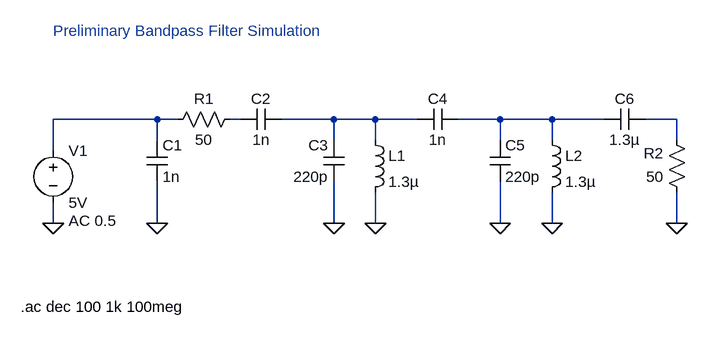
[diagram p0: schematic BandpassSimulation_1.asc]
BandpassSimulation_1.asc, the LTspice schematic file:
Version 4
SHEET 1 996 680
WIRE 176 64 16 64
WIRE 208 64 176 64
WIRE 304 64 288 64
WIRE 448 64 368 64
WIRE 512 64 448 64
WIRE 576 64 512 64
WIRE 704 64 640 64
WIRE 784 64 704 64
WIRE 864 64 784 64
WIRE 976 64 928 64
WIRE 176 96 176 64
WIRE 448 96 448 64
WIRE 512 96 512 64
WIRE 704 96 704 64
WIRE 784 96 784 64
WIRE 976 96 976 64
WIRE 16 112 16 64
WIRE 16 224 16 192
WIRE 176 224 176 160
WIRE 448 224 448 160
WIRE 512 224 512 176
WIRE 704 224 704 160
WIRE 784 224 784 176
WIRE 976 224 976 176
FLAG 16 224 0
FLAG 176 224 0
FLAG 448 224 0
FLAG 512 224 0
FLAG 704 224 0
FLAG 784 224 0
FLAG 976 224 0
SYMBOL cap 160 96 R0
SYMATTR InstName C1
SYMATTR Value 1n
SYMBOL cap 368 48 R90
WINDOW 0 0 32 VBottom 2
WINDOW 3 32 32 VTop 2
SYMATTR InstName C2
SYMATTR Value 1n
SYMBOL cap 464 160 R180
WINDOW 0 24 56 Left 2
WINDOW 3 24 8 Left 2
SYMATTR InstName C3
SYMATTR Value 220p
SYMBOL ind 496 80 R0
SYMATTR InstName L1
SYMATTR Value 1.3µ
SYMBOL cap 640 48 R90
WINDOW 0 0 32 VBottom 2
WINDOW 3 32 32 VTop 2
SYMATTR InstName C4
SYMATTR Value 1n
SYMBOL cap 688 96 R0
SYMATTR InstName C5
SYMATTR Value 220p
SYMBOL ind 768 80 R0
SYMATTR InstName L2
SYMATTR Value 1.3µ
SYMBOL cap 928 48 R90
WINDOW 0 0 32 VBottom 2
WINDOW 3 32 32 VTop 2
SYMATTR InstName C6
SYMATTR Value 1.3µ
SYMBOL res 304 48 R90
WINDOW 0 0 56 VBottom 2
WINDOW 3 32 56 VTop 2
SYMATTR InstName R1
SYMATTR Value 50
SYMBOL res 992 192 R180
WINDOW 0 36 76 Left 2
WINDOW 3 36 40 Left 2
SYMATTR InstName R2
SYMATTR Value 50
SYMBOL voltage 16 96 R0
WINDOW 123 24 124 Left 2
WINDOW 39 0 0 Left 0
SYMATTR InstName V1
SYMATTR Value 5V
SYMATTR Value2 AC 0.5
TEXT -34 352 Left 2 !.ac dec 100 1k 100meg
TEXT 16 -72 Left 2 ;Preliminary Bandpass Filter Simulation

The netlist it stands for:
* BandpassSimulation_1.asc
C1 N001 0 1n
C2 N003 N002 1n
C3 0 N003 220p
L1 N003 0 1.3µ
C4 N004 N003 1n
C5 N004 0 220p
L2 N004 0 1.3µ
C6 N005 N004 1.3µ
R1 N002 N001 50
R2 0 N005 50
V1 N001 0 5V AC 0.5
.ac dec 100 1k 100meg
* Preliminary Bandpass Filter Simulation
.backanno
.end